# EAGLE design osh_fab_tolerance_test (EAGLE 6.4)
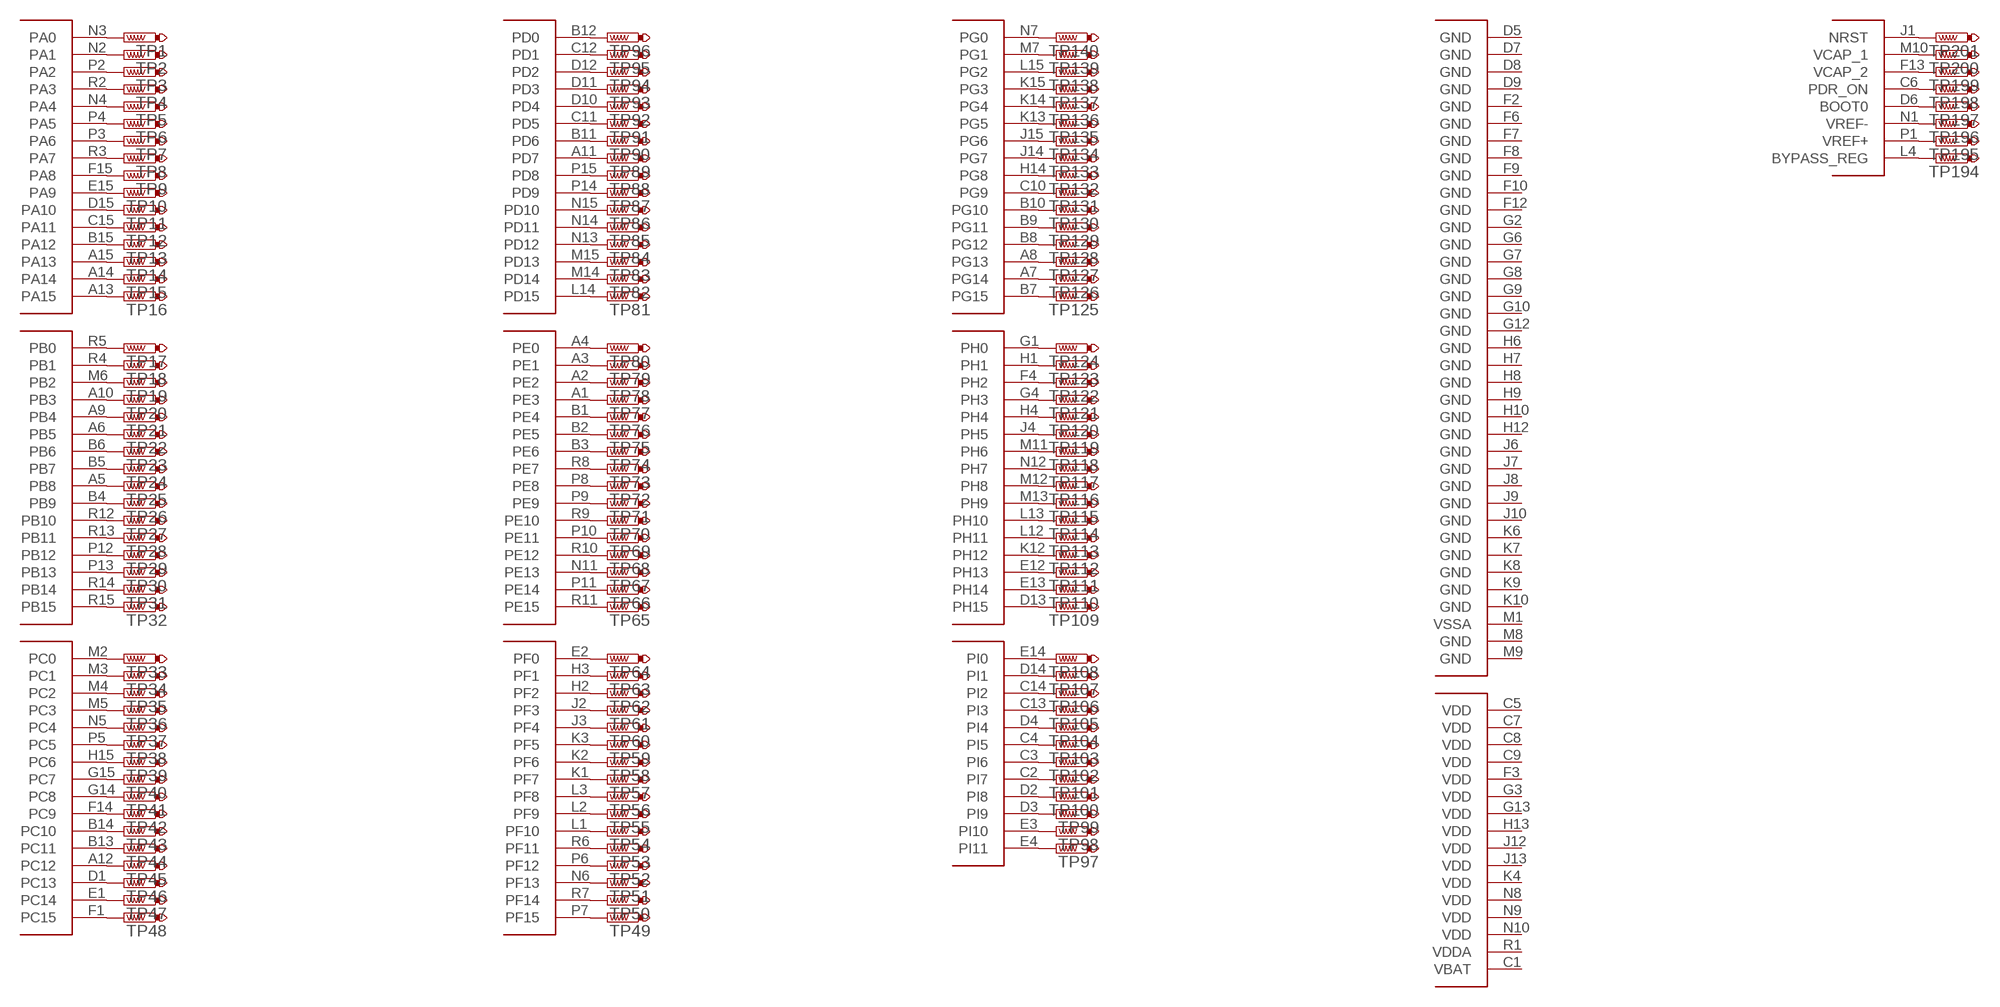
[diagram p0: schematic, sheet 1]

## Parts
TP1  PTR1TP09R  [TP09R]
TP2  PTR1TP09R  [TP09R]
TP3  PTR1TP09R  [TP09R]
TP4  PTR1TP09R  [TP09R]
TP5  PTR1TP09R  [TP09R]
TP6  PTR1TP09R  [TP09R]
TP7  PTR1TP09R  [TP09R]
TP8  PTR1TP09R  [TP09R]
TP9  PTR1TP09R  [TP09R]
TP10  PTR1TP09R  [TP09R]
TP11  PTR1TP09R  [TP09R]
TP12  PTR1TP09R  [TP09R]
TP13  PTR1TP09R  [TP09R]
TP14  PTR1TP09R  [TP09R]
TP15  PTR1TP09R  [TP09R]
TP16  PTR1TP09R  [TP09R]
TP17  PTR1TP09R  [TP09R]
TP18  PTR1TP09R  [TP09R]
TP19  PTR1TP09R  [TP09R]
TP20  PTR1TP09R  [TP09R]
TP21  PTR1TP09R  [TP09R]
TP22  PTR1TP09R  [TP09R]
TP23  PTR1TP09R  [TP09R]
TP24  PTR1TP09R  [TP09R]
TP25  PTR1TP09R  [TP09R]
TP26  PTR1TP09R  [TP09R]
TP27  PTR1TP09R  [TP09R]
TP28  PTR1TP09R  [TP09R]
TP29  PTR1TP09R  [TP09R]
TP30  PTR1TP09R  [TP09R]
TP31  PTR1TP09R  [TP09R]
TP32  PTR1TP09R  [TP09R]
TP33  PTR1TP09R  [TP09R]
TP34  PTR1TP09R  [TP09R]
TP35  PTR1TP09R  [TP09R]
TP36  PTR1TP09R  [TP09R]
TP37  PTR1TP09R  [TP09R]
TP38  PTR1TP09R  [TP09R]
TP39  PTR1TP09R  [TP09R]
TP40  PTR1TP09R  [TP09R]
TP41  PTR1TP09R  [TP09R]
TP42  PTR1TP09R  [TP09R]
TP43  PTR1TP09R  [TP09R]
TP44  PTR1TP09R  [TP09R]
TP45  PTR1TP09R  [TP09R]
TP46  PTR1TP09R  [TP09R]
TP47  PTR1TP09R  [TP09R]
TP48  PTR1TP09R  [TP09R]
TP49  PTR1TP09R  [TP09R]
TP50  PTR1TP09R  [TP09R]
TP51  PTR1TP09R  [TP09R]
TP52  PTR1TP09R  [TP09R]
TP53  PTR1TP09R  [TP09R]
TP54  PTR1TP09R  [TP09R]
TP55  PTR1TP09R  [TP09R]
TP56  PTR1TP09R  [TP09R]
TP57  PTR1TP09R  [TP09R]
TP58  PTR1TP09R  [TP09R]
TP59  PTR1TP09R  [TP09R]
TP60  PTR1TP09R  [TP09R]
TP61  PTR1TP09R  [TP09R]
TP62  PTR1TP09R  [TP09R]
TP63  PTR1TP09R  [TP09R]
TP64  PTR1TP09R  [TP09R]
TP65  PTR1TP09R  [TP09R]
TP66  PTR1TP09R  [TP09R]
TP67  PTR1TP09R  [TP09R]
TP68  PTR1TP09R  [TP09R]
TP69  PTR1TP09R  [TP09R]
TP70  PTR1TP09R  [TP09R]
TP71  PTR1TP09R  [TP09R]
TP72  PTR1TP09R  [TP09R]
TP73  PTR1TP09R  [TP09R]
TP74  PTR1TP09R  [TP09R]
TP75  PTR1TP09R  [TP09R]
TP76  PTR1TP09R  [TP09R]
TP77  PTR1TP09R  [TP09R]
TP78  PTR1TP09R  [TP09R]
TP79  PTR1TP09R  [TP09R]
TP80  PTR1TP09R  [TP09R]
TP81  PTR1TP09R  [TP09R]
TP82  PTR1TP09R  [TP09R]
TP83  PTR1TP09R  [TP09R]
TP84  PTR1TP09R  [TP09R]
TP85  PTR1TP09R  [TP09R]
TP86  PTR1TP09R  [TP09R]
TP87  PTR1TP09R  [TP09R]
TP88  PTR1TP09R  [TP09R]
TP89  PTR1TP09R  [TP09R]
TP90  PTR1TP09R  [TP09R]
TP91  PTR1TP09R  [TP09R]
TP92  PTR1TP09R  [TP09R]
TP93  PTR1TP09R  [TP09R]
TP94  PTR1TP09R  [TP09R]
TP95  PTR1TP09R  [TP09R]
TP96  PTR1TP09R  [TP09R]
TP97  PTR1TP09R  [TP09R]
TP98  PTR1TP09R  [TP09R]
TP99  PTR1TP09R  [TP09R]
TP100  PTR1TP09R  [TP09R]
TP101  PTR1TP09R  [TP09R]
TP102  PTR1TP09R  [TP09R]
TP103  PTR1TP09R  [TP09R]
TP104  PTR1TP09R  [TP09R]
TP105  PTR1TP09R  [TP09R]
TP106  PTR1TP09R  [TP09R]
TP107  PTR1TP09R  [TP09R]
TP108  PTR1TP09R  [TP09R]
TP109  PTR1TP09R  [TP09R]
TP110  PTR1TP09R  [TP09R]
TP111  PTR1TP09R  [TP09R]
TP112  PTR1TP09R  [TP09R]
TP113  PTR1TP09R  [TP09R]
TP114  PTR1TP09R  [TP09R]
TP115  PTR1TP09R  [TP09R]
TP116  PTR1TP09R  [TP09R]
TP117  PTR1TP09R  [TP09R]
TP118  PTR1TP09R  [TP09R]
TP119  PTR1TP09R  [TP09R]
TP120  PTR1TP09R  [TP09R]
TP121  PTR1TP09R  [TP09R]
TP122  PTR1TP09R  [TP09R]
TP123  PTR1TP09R  [TP09R]
TP124  PTR1TP09R  [TP09R]
TP125  PTR1TP09R  [TP09R]
TP126  PTR1TP09R  [TP09R]
TP127  PTR1TP09R  [TP09R]
TP128  PTR1TP09R  [TP09R]
TP129  PTR1TP09R  [TP09R]
TP130  PTR1TP09R  [TP09R]
TP131  PTR1TP09R  [TP09R]
TP132  PTR1TP09R  [TP09R]
TP133  PTR1TP09R  [TP09R]
TP134  PTR1TP09R  [TP09R]
TP135  PTR1TP09R  [TP09R]
TP136  PTR1TP09R  [TP09R]
TP137  PTR1TP09R  [TP09R]
TP138  PTR1TP09R  [TP09R]
TP139  PTR1TP09R  [TP09R]
TP140  PTR1TP09R  [TP09R]
TP194  PTR1TP09R  [TP09R]
TP195  PTR1TP09R  [TP09R]
TP196  PTR1TP09R  [TP09R]
TP197  PTR1TP09R  [TP09R]
TP198  PTR1TP09R  [TP09R]
TP199  PTR1TP09R  [TP09R]
TP200  PTR1TP09R  [TP09R]
TP201  PTR1TP09R  [TP09R]
U$1  STM32_32BIT_MCU_STM32F407IG  [STM32_32BIT_MCU_UFBGA176+25]

## Nets
N$1: TP1.TP U$1.N3(PA0)
N$2: TP2.TP U$1.N2(PA1)
N$3: TP3.TP U$1.P2(PA2)
N$4: TP4.TP U$1.R2(PA3)
N$5: TP5.TP U$1.N4(PA4)
N$6: TP6.TP U$1.P4(PA5)
N$7: TP7.TP U$1.P3(PA6)
N$8: TP8.TP U$1.R3(PA7)
N$9: TP9.TP U$1.F15(PA8)
N$10: TP10.TP U$1.E15(PA9)
N$11: TP11.TP U$1.D15(PA10)
N$12: TP12.TP U$1.C15(PA11)
N$13: TP13.TP U$1.B15(PA12)
N$14: TP14.TP U$1.A15(PA13)
N$15: TP15.TP U$1.A14
N$16: TP16.TP U$1.A13(PA15)
N$17: TP17.TP U$1.R5(PB0)
N$18: TP18.TP U$1.R4(PB1)
N$19: TP19.TP U$1.M6(PB2)
N$20: TP20.TP U$1.A10(PB3)
N$21: TP21.TP U$1.A9(PB4)
N$22: TP22.TP U$1.A6(PB5)
N$23: TP23.TP U$1.B6
N$24: TP24.TP U$1.B5(PB7)
N$25: TP25.TP U$1.A5(PB8)
N$26: TP26.TP U$1.B4(PB9)
N$27: TP27.TP U$1.R12(PB10)
N$28: TP28.TP U$1.R13(PB11)
N$29: TP29.TP U$1.P12(PB12)
N$30: TP30.TP U$1.P13(PB13)
N$31: TP31.TP U$1.R14(PB14)
N$32: TP32.TP U$1.R15(PB15)
N$33: TP33.TP U$1.M2(PC0)
N$34: TP34.TP U$1.M3(PC1)
N$35: TP35.TP U$1.M4(PC2)
N$36: TP36.TP U$1.M5(PC3)
N$37: TP37.TP U$1.N5(PC4)
N$38: TP38.TP U$1.P5(PC5)
N$39: TP39.TP U$1.H15(PC6)
N$40: TP40.TP U$1.G15(PC7)
N$41: TP41.TP U$1.G14(PC8)
N$42: TP42.TP U$1.F14(PC9)
N$43: TP43.TP U$1.B14(PC10)
N$44: TP44.TP U$1.B13(PC11)
N$45: TP45.TP U$1.A12(PC12)
N$46: TP46.TP U$1.D1(PC13)
N$47: TP47.TP U$1.E1(PC14)
N$48: TP48.TP U$1.F1(PC15)
N$49: TP49.TP U$1.P7(PF15)
N$50: TP50.TP U$1.R7(PF14)
N$51: TP51.TP U$1.N6(PF13)
N$52: TP52.TP U$1.P6(PF12)
N$53: TP53.TP U$1.R6(PF11)
N$54: TP54.TP U$1.L1(PF10)
N$55: TP55.TP U$1.L2(PF9)
N$56: TP56.TP U$1.L3(PF8)
N$57: TP57.TP U$1.K1(PF7)
N$58: TP58.TP U$1.K2(PF6)
N$59: TP59.TP U$1.K3(PF5)
N$60: TP60.TP U$1.J3(PF4)
N$61: TP61.TP U$1.J2(PF3)
N$62: TP62.TP U$1.H2(PF2)
N$63: TP63.TP U$1.H3(PF1)
N$64: TP64.TP U$1.E2(PF0)
N$65: TP65.TP U$1.R11(PE15)
N$66: TP66.TP U$1.P11(PE14)
N$67: TP67.TP U$1.N11(PE13)
N$68: TP68.TP U$1.R10(PE12)
N$69: TP69.TP U$1.P10(PE11)
N$70: TP70.TP U$1.R9(PE10)
N$71: TP71.TP U$1.P9(PE9)
N$72: TP72.TP U$1.P8(PE8)
N$73: TP73.TP U$1.R8(PE7)
N$74: TP74.TP U$1.B3(PE6)
N$75: TP75.TP U$1.B2(PE5)
N$76: TP76.TP U$1.B1(PE4)
N$77: TP77.TP U$1.A1(PE3)
N$78: TP78.TP U$1.A2(PE2)
N$79: TP79.TP U$1.A3(PE1)
N$80: TP80.TP U$1.A4(PE0)
N$81: TP81.TP U$1.L14(PD15)
N$82: TP82.TP U$1.M14(PD14)
N$83: TP83.TP U$1.M15(PD13)
N$84: TP84.TP U$1.N13(PD12)
N$85: TP85.TP U$1.N14(PD11)
N$86: TP86.TP U$1.N15(PD10)
N$87: TP87.TP U$1.P14(PD9)
N$88: TP88.TP U$1.P15(PD8)
N$89: TP89.TP U$1.A11(PD7)
N$90: TP90.TP U$1.B11(PD6)
N$91: TP91.TP U$1.C11(PD5)
N$92: TP92.TP U$1.D10(PD4)
N$93: TP93.TP U$1.D11(PD3)
N$94: TP94.TP U$1.D12(PD2)
N$95: TP95.TP U$1.C12(PD1)
N$96: TP96.TP U$1.B12(PD0)
N$97: TP97.TP U$1.E4(PI11)
N$98: TP98.TP U$1.E3(PI10)
N$99: TP99.TP U$1.D3(PI9)
N$100: TP100.TP U$1.D2(PI8)
N$101: TP101.TP U$1.C2(PI7)
N$102: TP102.TP U$1.C3(PI6)
N$103: TP103.TP U$1.C4(PI5)
N$104: TP104.TP U$1.D4(PI4)
N$105: TP105.TP U$1.C13(PI3)
N$106: TP106.TP U$1.C14(PI2)
N$107: TP107.TP U$1.D14(PI1)
N$108: TP108.TP U$1.E14(PI0)
N$109: TP109.TP U$1.D13(PH15)
N$110: TP110.TP U$1.E13(PH14)
N$111: TP111.TP U$1.E12(PH13)
N$112: TP112.TP U$1.K12(PH12)
N$113: TP113.TP U$1.L12(PH11)
N$114: TP114.TP U$1.L13(PH10)
N$115: TP115.TP U$1.M13(PH9)
N$116: TP116.TP U$1.M12(PH8)
N$117: TP117.TP U$1.N12(PH7)
N$118: TP118.TP U$1.M11(PH6)
N$119: TP119.TP U$1.J4(PH5)
N$120: TP120.TP U$1.H4
N$121: TP121.TP U$1.G4(PH3)
N$122: TP122.TP U$1.F4(PH2)
N$123: TP123.TP U$1.H1
N$124: TP124.TP U$1.G1(PH0)
N$125: TP125.TP U$1.B7(PG15)
N$126: TP126.TP U$1.A7(PG14)
N$127: TP127.TP U$1.A8(PG13)
N$128: TP128.TP U$1.B8(PG12)
N$129: TP129.TP U$1.B9(PG11)
N$130: TP130.TP U$1.B10(PG10)
N$131: TP131.TP U$1.C10(PG9)
N$132: TP132.TP U$1.H14(PG8)
N$133: TP133.TP U$1.J14(PG7)
N$134: TP134.TP U$1.J15(PG6)
N$135: TP135.TP U$1.K13(PG5)
N$136: TP136.TP U$1.K14(PG4)
N$137: TP137.TP U$1.K15(PG3)
N$138: TP138.TP U$1.L15(PG2)
N$139: TP139.TP U$1.M7(PG1)
N$140: TP140.TP U$1.N7(PG0)
N$194: TP194.TP U$1.L4(BYPASS_REG)
N$195: TP195.TP U$1.P1(VREF+)
N$196: TP196.TP U$1.N1(VREF-)
N$197: TP197.TP U$1.D6(BOOT0)
N$198: TP198.TP U$1.C6(PDR_ON)
N$199: TP199.TP U$1.F13(VCAP_2)
N$200: TP200.TP U$1.M10(VCAP_1)
N$201: TP201.TP U$1.J1(NRST)
Unconnected: U$1.C1(VBAT) U$1.C5(VDD) U$1.C7(VDD) U$1.C8(VDD) U$1.C9(VDD) U$1.D5(GND) U$1.D7(GND) U$1.D8(GND) U$1.D9(GND) U$1.F2(GND) U$1.F3(VDD) U$1.F6(GND) U$1.F7(GND) U$1.F8(GND) U$1.F9(GND) U$1.F10(GND) U$1.F12(GND) U$1.G2(GND) U$1.G3(VDD) U$1.G6(GND) U$1.G7(GND) U$1.G8(GND) U$1.G9(GND) U$1.G10(GND) U$1.G12(GND) U$1.G13(VDD) U$1.H6(GND) U$1.H7(GND) U$1.H8(GND) U$1.H9(GND) U$1.H10(GND) U$1.H12(GND) U$1.H13(VDD) U$1.J6(GND) U$1.J7(GND) U$1.J8(GND) U$1.J9(GND) U$1.J10(GND) U$1.J12(VDD) U$1.J13(VDD) U$1.K4(VDD) U$1.K6(GND) U$1.K7(GND) U$1.K8(GND) U$1.K9(GND) U$1.K10(GND) U$1.M1(VSSA) U$1.M8(GND) U$1.M9(GND) U$1.N8(VDD) U$1.N9(VDD) U$1.N10(VDD) U$1.R1(VDDA)

## Library data of the parts
TP1-TP140 TP194-TP201 = testpad:PTR1: TEST PIN
U$1 = logic:STM32_32BIT_MCU_STM32F407IG

## Board
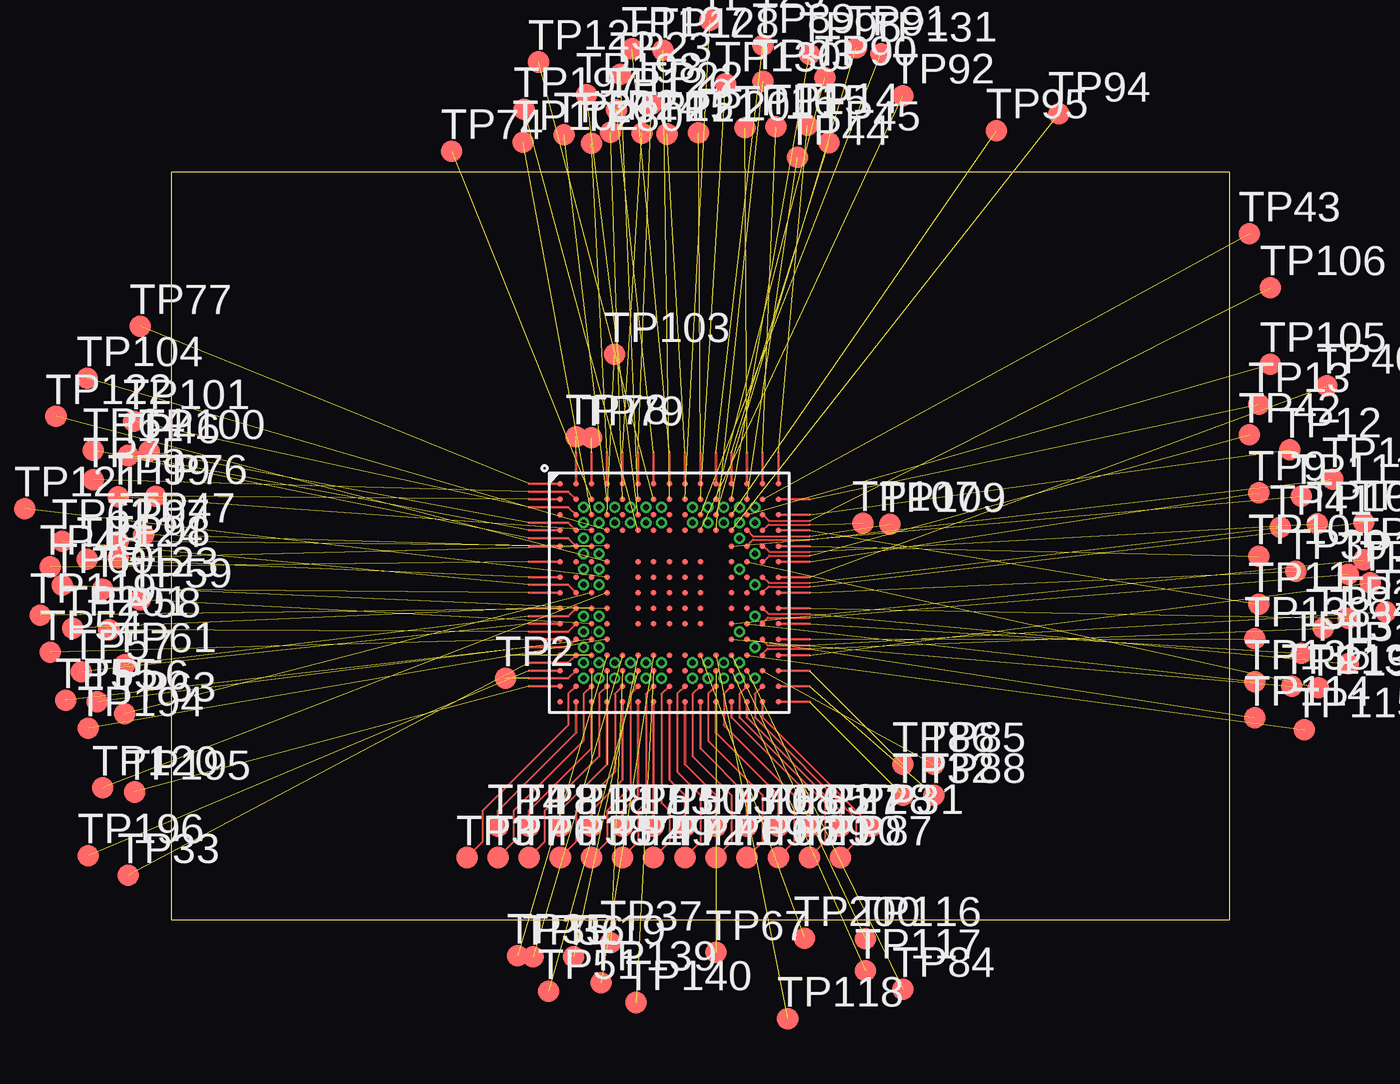
[diagram p1: board, top side]
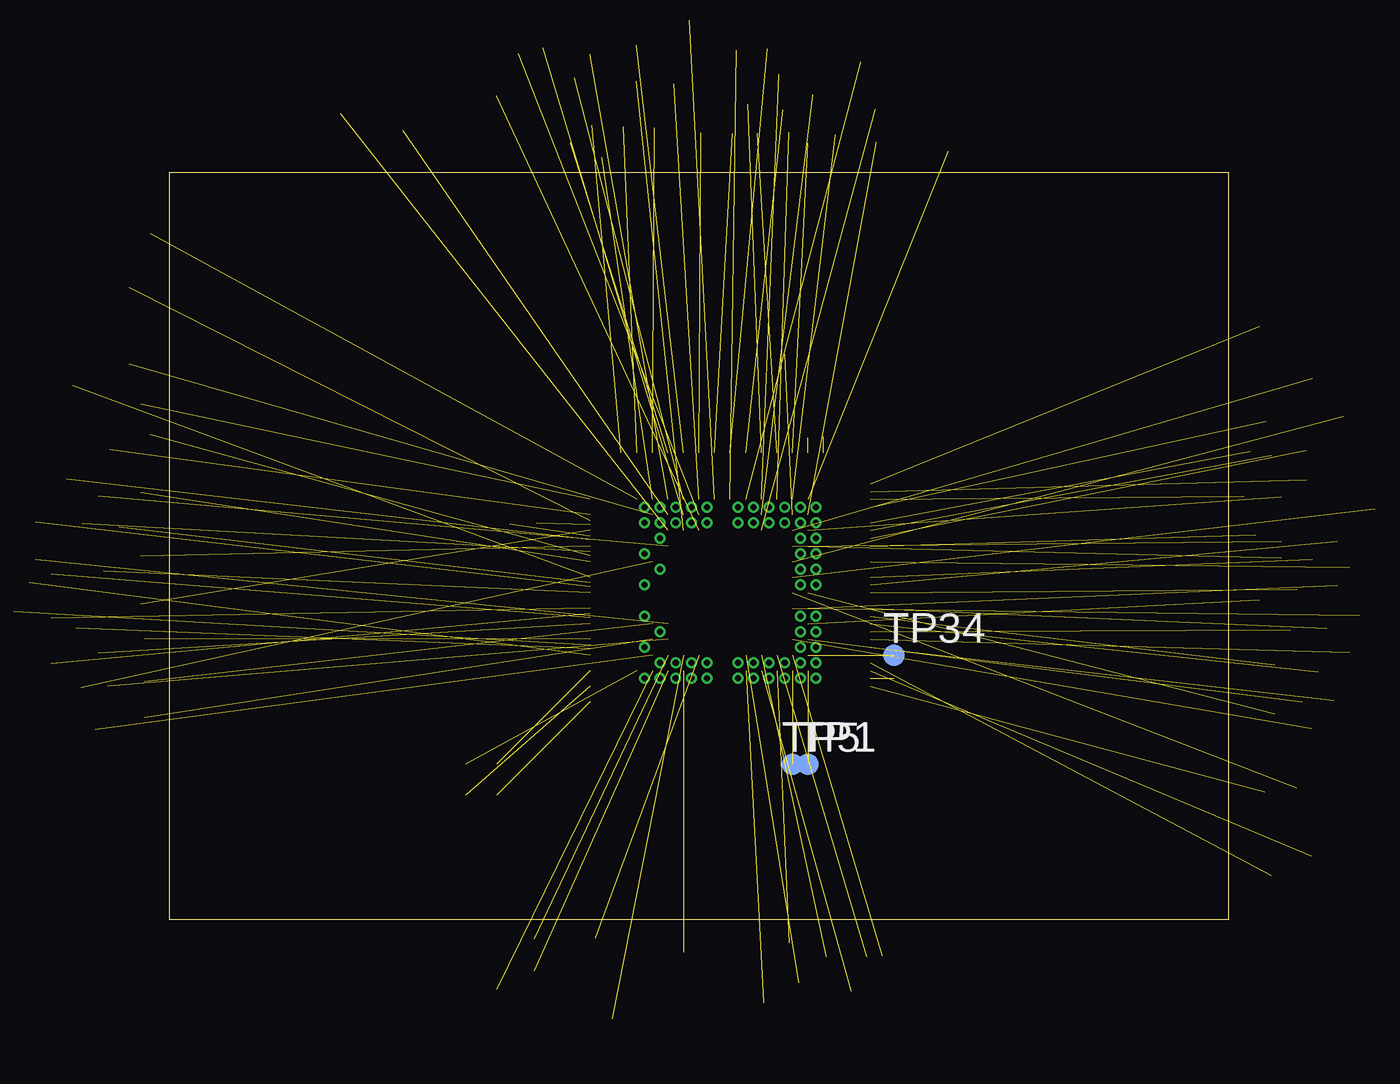
[diagram p2: board, bottom side, seen from below]

Size 44.2 x 31.2 mm. Coordinates in mm from the lower left corner, seen from the top.
Outline: 0,0 44.2,0 44.2,31.2 0,31.2 0,0
Copper layers (1*2*3*16): Top 0.035mm / dielectric 1.5mm / Route2 0.035mm / dielectric 0.15mm / Route3 0.035mm / dielectric 0.2mm / Bottom 0.035mm
Design rules "default *": minimum track width 3mil, minimum drill 10mil, track to track 3mil, track to pad 3mil, pad to pad 3mil, via to via 3mil, smd to smd 3mil, copper to edge 15mil, drill to drill 8mil, minimum pad ring 4mil, minimum via ring 4mil, stop-mask expansion 4mil, vias tented up to drill 16mil, thermal gap 10mil

### Footprints (pad centres in the part's own frame; a part is rotated, then mirrored left to right if it is on the bottom)
TP09R = smd 0.9 x 0.9: TP 0,0
STM32_32BIT_MCU_UFBGA176+25 = smd 0.23 x 0.23: A1 -4.55,4.55; A2 -3.9,4.55; A3 -3.25,4.55; A4 -2.6,4.55; A5 -1.95,4.55; A6 -1.3,4.55; A7 -0.65,4.55; A8 0,4.55; A9 0.65,4.55; A10 1.3,4.55; A11 1.95,4.55; A12 2.6,4.55; A13 3.25,4.55; A14 3.9,4.55; A15 4.55,4.55; B1 -4.55,3.9; B2 -3.9,3.9; B3 -3.25,3.9; B4 -2.6,3.9; B5 -1.95,3.9; B6 -1.3,3.9; B7 -0.65,3.9; B8 0,3.9; B9 0.65,3.9; B10 1.3,3.9; B11 1.95,3.9; B12 2.6,3.9; B13 3.25,3.9; B14 3.9,3.9; B15 4.55,3.9; C1 -4.55,3.25; C2 -3.9,3.25; C3 -3.25,3.25; C4 -2.6,3.25; C5 -1.95,3.25; C6 -1.3,3.25; C7 -0.65,3.25; C8 0,3.25; C9 0.65,3.25; C10 1.3,3.25; C11 1.95,3.25; C12 2.6,3.25; C13 3.25,3.25; C14 3.9,3.25; C15 4.55,3.25; D1 -4.55,2.6; D2 -3.9,2.6; D3 -3.25,2.6; D4 -2.6,2.6; D5 -1.95,2.6; D6 -1.3,2.6; D7 -0.65,2.6; D8 0,2.6; D9 0.65,2.6; D10 1.3,2.6; D11 1.95,2.6; D12 2.6,2.6; D13 3.25,2.6; D14 3.9,2.6; D15 4.55,2.6; E1 -4.55,1.95; E2 -3.9,1.95; E3 -3.25,1.95; E4 -2.6,1.95; E12 2.6,1.95; E13 3.25,1.95; E14 3.9,1.95; E15 4.55,1.95; F1 -4.55,1.3; F2 -3.9,1.3; F3 -3.25,1.3; F4 -2.6,1.3; F6 -1.3,1.3; F7 -0.65,1.3; F8 0,1.3; F9 0.65,1.3; F10 1.3,1.3; F12 2.6,1.3; F13 3.25,1.3; F14 3.9,1.3; F15 4.55,1.3; G1 -4.55,0.65; G2 -3.9,0.65; G3 -3.25,0.65; G4 -2.6,0.65; G6 -1.3,0.65; G7 -0.65,0.65; G8 0,0.65; G9 0.65,0.65; G10 1.3,0.65; G12 2.6,0.65; G13 3.25,0.65; G14 3.9,0.65; G15 4.55,0.65; H1 -4.55,0; H2 -3.9,0; H3 -3.25,0; H4 -2.6,0; H6 -1.3,0; H7 -0.65,0; H8 0,0; H9 0.65,0; H10 1.3,0; H12 2.6,0; H13 3.25,0; H14 3.9,0; H15 4.55,0; J1 -4.55,-0.65; J2 -3.9,-0.65; J3 -3.25,-0.65; J4 -2.6,-0.65; J6 -1.3,-0.65; J7 -0.65,-0.65; J8 0,-0.65; J9 0.65,-0.65; J10 1.3,-0.65; J12 2.6,-0.65; J13 3.25,-0.65; J14 3.9,-0.65; J15 4.55,-0.65; K1 -4.55,-1.3; K2 -3.9,-1.3; K3 -3.25,-1.3; K4 -2.6,-1.3; K6 -1.3,-1.3; K7 -0.65,-1.3; K8 0,-1.3; K9 0.65,-1.3; K10 1.3,-1.3; K12 2.6,-1.3; K13 3.25,-1.3; K14 3.9,-1.3; K15 4.55,-1.3; L1 -4.55,-1.95; L2 -3.9,-1.95; L3 -3.25,-1.95; L4 -2.6,-1.95; L12 2.6,-1.95; L13 3.25,-1.95; L14 3.9,-1.95; L15 4.55,-1.95; M1 -4.55,-2.6; M2 -3.9,-2.6; M3 -3.25,-2.6; M4 -2.6,-2.6; M5 -1.95,-2.6; M6 -1.3,-2.6; M7 -0.65,-2.6; M8 0,-2.6; M9 0.65,-2.6; M10 1.3,-2.6; M11 1.95,-2.6; M12 2.6,-2.6; M13 3.25,-2.6; M14 3.9,-2.6; M15 4.55,-2.6; N1 -4.55,-3.25; N2 -3.9,-3.25; N3 -3.25,-3.25; N4 -2.6,-3.25; N5 -1.95,-3.25; N6 -1.3,-3.25; N7 -0.65,-3.25; N8 0,-3.25; N9 0.65,-3.25; N10 1.3,-3.25; N11 1.95,-3.25; N12 2.6,-3.25; N13 3.25,-3.25; N14 3.9,-3.25; N15 4.55,-3.25; P1 -4.55,-3.9; P2 -3.9,-3.9; P3 -3.25,-3.9; P4 -2.6,-3.9; P5 -1.95,-3.9; P6 -1.3,-3.9; P7 -0.65,-3.9; P8 0,-3.9; P9 0.65,-3.9; P10 1.3,-3.9; P11 1.95,-3.9; P12 2.6,-3.9; P13 3.25,-3.9; P14 3.9,-3.9; P15 4.55,-3.9; R1 -4.55,-4.55; R2 -3.9,-4.55; R3 -3.25,-4.55; R4 -2.6,-4.55; R5 -1.95,-4.55; R6 -1.3,-4.55; R7 -0.65,-4.55; R8 0,-4.55; R9 0.65,-4.55; R10 1.3,-4.55; R11 1.95,-4.55; R12 2.6,-4.55; R13 3.25,-4.55; R14 3.9,-4.55; R15 4.55,-4.55

### Placement (x,y rotation side)
TP1  17.55,6.5 0 bottom
TP2  13.97,10.08 0 top
TP3  12.35,2.6 0 top
TP4  13.65,3.9 0 top
TP5  18.2,6.5 0 bottom
TP6  14.95,2.6 0 top
TP7  13.65,2.6 0 top
TP8  14.95,3.9 0 top
TP9  45.41,17.82 0 top
TP10  45.41,15.17 0 top
TP11  45.41,13.17 0 top
TP12  46.71,19.61 0 top
TP13  45.41,21.51 0 top
TP14  26.56,33.16 0 top
TP15  25.26,33.11 0 top
TP16  23.96,33.06 0 top
TP17  17.55,3.9 0 top
TP18  16.25,3.9 0 top
TP19  16.81,-1.55 0 top
TP20  22.01,32.85 0 top
TP21  20.71,32.8 0 top
TP22  20.06,34.04 0 top
TP23  18.76,35.29 0 top  (outside the outline)
TP24  18.36,32.87 0 top
TP25  19.66,32.82 0 top
TP26  16.41,32.77 0 top
TP27  26.65,3.9 0 top
TP28  27.95,3.9 0 top
TP29  25.35,2.6 0 top
TP30  26.65,2.6 0 top
TP31  29.25,3.9 0 top
TP32  30.55,5.2 0 top
TP33  -1.79,1.85 0 top
TP34  13.97,11.05 0 bottom
TP35  14.46,-1.5 0 top
TP36  15.11,-1.55 0 top
TP37  18.36,-0.95 0 top
TP38  16.25,2.6 0 top
TP39  46.96,14.54 0 top
TP40  48.26,22.29 0 top  (outside the outline)
TP41  46.31,16.39 0 top
TP42  45.01,20.24 0 top
TP43  45.01,28.63 0 top
TP44  26.16,31.83 0 top
TP45  27.46,32.43 0 top
TP46  -1.79,19.38 0 top
TP47  -1.14,16.08 0 top
TP48  -5.04,14.72 0 top  (outside the outline)
TP49  18.85,2.6 0 top
TP50  20.15,3.9 0 top
TP51  15.76,-2.98 0 top
TP52  17.55,2.6 0 top
TP53  18.85,3.9 0 top
TP54  -5.04,11.16 0 top  (outside the outline)
TP55  -4.39,9.16 0 top  (outside the outline)
TP56  -3.09,9.11 0 top  (outside the outline)
TP57  -3.74,10.36 0 top  (outside the outline)
TP58  -2.59,12.11 0 top
TP59  -1.29,13.36 0 top
TP60  -4.54,13.95 0 top  (outside the outline)
TP61  -1.94,10.65 0 top
TP62  -4.54,15.8 0 top  (outside the outline)
TP63  -1.94,8.6 0 top
TP64  -3.24,19.6 0 top  (outside the outline)
TP65  25.35,3.9 0 top
TP66  24.05,2.6 0 top
TP67  22.76,-1.36 0 top
TP68  24.05,3.9 0 top
TP69  22.75,2.6 0 top
TP70  22.75,3.9 0 top
TP71  21.45,2.6 0 top
TP72  20.15,2.6 0 top
TP73  21.45,3.9 0 top
TP74  11.71,32.08 0 top
TP75  -3.24,18.38 0 top  (outside the outline)
TP76  -0.64,17.67 0 top
TP77  -1.29,24.77 0 top
TP78  16.91,20.17 0 top
TP79  17.56,20.12 0 top
TP80  17.56,32.41 0 top
TP81  50.71,12.86 0 top  (outside the outline)
TP82  48.11,12.16 0 top  (outside the outline)
TP83  50.06,14.06 0 top  (outside the outline)
TP84  30.56,-2.89 0 top
TP85  31.85,6.5 0 top
TP86  30.55,6.5 0 top
TP87  27.95,2.6 0 top
TP88  31.85,5.2 0 top
TP89  24.71,36.5 0 top  (outside the outline)
TP90  27.31,35.15 0 top  (outside the outline)
TP91  28.61,36.39 0 top  (outside the outline)
TP92  30.56,34.39 0 top  (outside the outline)
TP93  24.71,34.99 0 top  (outside the outline)
TP94  37.06,33.64 0 top
TP95  34.46,32.93 0 top
TP96  26.66,36.13 0 top  (outside the outline)
TP97  -2.21,15.81 0 top
TP98  -2.21,15.11 0 top
TP99  -2.21,17.65 0 top
TP100  -0.91,19.55 0 top
TP101  -1.55,20.8 0 top
TP102  14.69,32.45 0 top
TP103  18.51,23.6 0 top
TP104  -3.51,22.59 0 top  (outside the outline)
TP105  45.89,23.19 0 top
TP106  45.89,26.39 0 top
TP107  28.88,16.56 0 top
TP108  47.84,16.54 0 top  (outside the outline)
TP109  30.01,16.51 0 top
TP110  48.49,18.38 0 top  (outside the outline)
TP111  47.19,17.68 0 top
TP112  49.8,15.03 0 top  (outside the outline)
TP113  46.8,9.75 0 top
TP114  45.24,8.42 0 top
TP115  47.32,7.93 0 top  (outside the outline)
TP116  28.99,-0.78 0 top
TP117  28.99,-2.13 0 top
TP118  25.74,-4.13 0 top  (outside the outline)
TP119  -5.46,12.71 0 top  (outside the outline)
TP120  -2.86,5.51 0 top
TP121  -6.11,17.16 0 top  (outside the outline)
TP122  -4.8,21.01 0 top  (outside the outline)
TP123  -2.86,13.8 0 top
TP124  -3.51,15.05 0 top  (outside the outline)
TP125  15.34,35.8 0 top  (outside the outline)
TP126  18.59,33.8 0 top
TP127  19.24,36.35 0 top  (outside the outline)
TP128  20.55,36.29 0 top  (outside the outline)
TP129  22.49,37.54 0 top  (outside the outline)
TP130  23.14,34.89 0 top  (outside the outline)
TP131  29.64,36.14 0 top  (outside the outline)
TP132  49.8,16.59 0 top  (outside the outline)
TP133  49.14,10.69 0 top  (outside the outline)
TP134  49.14,12.58 0 top  (outside the outline)
TP135  45.24,9.93 0 top
TP136  49.14,14.43 0 top  (outside the outline)
TP137  47.19,11.13 0 top
TP138  45.24,11.73 0 top
TP139  17.94,-2.63 0 top
TP140  19.42,-3.45 0 top  (outside the outline)
TP194  -3.46,7.99 0 top  (outside the outline)
TP195  -1.51,5.33 0 top
TP196  -3.46,2.68 0 top  (outside the outline)
TP197  14.74,33.83 0 top
TP198  17.34,34.43 0 top  (outside the outline)
TP199  47.89,9.68 0 top  (outside the outline)
TP200  26.44,-0.78 0 top
TP201  -4.11,12.17 0 top  (outside the outline)
U$1  20.8,13.65 0 top

### Tracks (layer width: path | path; a pad name or v marks a point on that pad's centre or on a via)
N$1  (1 unrouted)
N$2  (1 unrouted)
  Top 0.102: U$1.N2 16.58,10.08 14.95,10.08
N$3
  Top 0.076: U$1.P2 16.58,9.43 16.58,8.12 13,4.55 13,3.25 TP3.TP
N$4
  Top 0.102: U$1.R2 16.9,7.8 13.65,4.55 TP4.TP
N$5  (1 unrouted)
N$6
  Top 0.076: U$1.P4 17.88,9.43 17.88,6.83 15.6,4.55 15.6,3.25 TP6.TP
N$7
  Top 0.076: U$1.P3 17.22,9.43 17.22,7.48 14.3,4.55 14.3,3.25 TP7.TP
N$8
  Top 0.102: U$1.R3 17.55,7.15 14.95,4.55 TP8.TP
N$9  (1 unrouted)
  Top 0.102: U$1.F15 26.65,14.95
N$10  (1 unrouted)
  Top 0.102: U$1.E15 26.65,15.6
N$11  (1 unrouted)
  Top 0.102: U$1.D15 26.65,16.25
N$12  (1 unrouted)
  Top 0.102: U$1.C15 26.65,16.9
N$13  (1 unrouted)
  Top 0.102: U$1.B15 26.65,17.55
N$14  (1 unrouted)
  Top 0.102: U$1.A15 25.35,19.5
N$15  (1 unrouted)
  Top 0.102: U$1.A14 24.7,19.5
N$16  (1 unrouted)
  Top 0.102: U$1.A13 24.05,19.5
N$17
  Top 0.102: U$1.R5 18.85,5.85 17.55,4.55 TP17.TP
N$18
  Top 0.102: U$1.R4 18.2,6.5 16.25,4.55 TP18.TP
N$19  (1 unrouted)
N$20  (1 unrouted)
  Top 0.102: U$1.A10 22.1,19.5
N$21  (1 unrouted)
  Top 0.102: U$1.A9 21.45,19.5
N$22  (1 unrouted)
  Top 0.102: U$1.A6 19.5,19.5
N$23  (1 unrouted)
N$24  (1 unrouted)
N$25  (1 unrouted)
  Top 0.102: U$1.A5 18.85,19.5
N$26  (1 unrouted)
N$27
  Top 0.102: U$1.R12 23.4,8.45 26.65,5.2 TP27.TP
N$28
  Top 0.102: U$1.R13 24.05,8.45 27.95,4.55 TP28.TP
N$29
  Top 0.076: U$1.P12 23.08,9.43 23.08,8.12 26,5.2 26,3.25 TP29.TP
N$30
  Top 0.076: U$1.P13 23.72,9.43 23.72,8.45 27.3,4.88 27.3,3.25 TP30.TP
N$31
  Top 0.102: U$1.R14 24.7,8.45 TP31.TP
N$32  (1 unrouted)
  Top 0.102: U$1.R15 26.65,9.1
N$33  (1 unrouted)
  Top 0.102: U$1.M2 16.58,10.73 14.95,10.73
N$34  (1 unrouted)
N$35  (1 unrouted)
N$36  (1 unrouted)
N$37  (1 unrouted)
N$38
  Top 0.076: U$1.P5 18.52,9.43 18.52,6.18 16.9,4.55 16.9,3.25 TP38.TP
N$39  (1 unrouted)
  Top 0.102: U$1.H15 26.65,13.65
N$40  (1 unrouted)
  Top 0.102: U$1.G15 26.65,14.3
N$41  (1 unrouted)
  Top 0.076: U$1.G14 24.72,14.3 24.96,14.06 26.66,14.06
N$42  (1 unrouted)
  Top 0.076: U$1.F14 24.73,14.95 24.98,15.2 26.66,15.2
N$43  (1 unrouted)
N$44  (1 unrouted)
N$45  (1 unrouted)
  Top 0.102: U$1.A12 23.4,19.5
N$46  (1 unrouted)
  Top 0.102: U$1.D1 14.95,16.25
N$47  (1 unrouted)
  Top 0.102: U$1.E1 14.95,15.6
N$48  (1 unrouted)
  Top 0.102: U$1.F1 14.95,14.95
N$49
  Top 0.076: U$1.P7 19.83,9.43 19.83,4.88 19.5,4.55 19.5,3.25 TP49.TP
N$50
  Top 0.102: U$1.R7 TP50.TP
N$51  (1 unrouted)
N$52
  Top 0.076: U$1.P6 19.17,9.43 19.17,5.52 18.2,4.55 18.2,3.25 TP52.TP
N$53
  Top 0.102: U$1.R6 19.5,5.2 18.85,4.55 TP53.TP
N$54  (1 unrouted)
  Top 0.102: U$1.L1 14.95,11.7
N$55  (1 unrouted)
  Top 0.102: U$1.L2 16.58,11.38 14.95,11.38
N$56  (1 unrouted)
N$57  (1 unrouted)
  Top 0.102: U$1.K1 14.95,12.35
N$58  (1 unrouted)
  Top 0.102: U$1.K2 16.58,12.02 14.95,12.02
N$59  (1 unrouted)
N$60  (1 unrouted)
N$61  (1 unrouted)
  Top 0.102: U$1.J2 16.58,12.68 14.95,12.68
N$62  (1 unrouted)
  Top 0.102: U$1.H2 16.58,13.98 14.95,13.98
N$63  (1 unrouted)
N$64  (1 unrouted)
  Top 0.102: U$1.E2 16.58,15.93 14.95,15.93
N$65
  Top 0.102: U$1.R11 22.75,7.8 25.35,5.2 TP65.TP
N$66
  Top 0.076: U$1.P11 22.42,9.43 22.42,7.48 24.7,5.2 24.7,3.25 TP66.TP
N$67  (1 unrouted)
N$68
  Top 0.102: U$1.R10 22.1,7.15 24.05,5.2 TP68.TP
N$69
  Top 0.076: U$1.P10 21.77,9.43 21.77,6.83 23.4,5.2 23.4,3.25 TP69.TP
N$70
  Top 0.102: U$1.R9 21.45,6.5 22.75,5.2 TP70.TP
N$71
  Top 0.076: U$1.P9 21.12,9.43 21.12,6.18 22.1,5.2 22.1,3.25 TP71.TP
N$72
  Top 0.076: U$1.P8 20.47,9.43 20.47,4.88 20.8,4.55 20.8,3.25 TP72.TP
N$73
  Top 0.102: U$1.R8 20.8,5.85 21.45,5.2 TP73.TP
N$74  (1 unrouted)
N$75  (1 unrouted)
  Top 0.102: U$1.B2 16.58,17.88 14.95,17.88
N$76  (1 unrouted)
  Top 0.102: U$1.B1 14.95,17.55
N$77  (1 unrouted)
  Top 0.102: U$1.A1 14.95,18.2
N$78  (1 unrouted)
  Top 0.102: U$1.A2 16.9,19.5
N$79  (1 unrouted)
  Top 0.102: U$1.A3 17.55,19.5
N$80  (1 unrouted)
  Top 0.102: U$1.A4 18.2,19.5
N$81  (1 unrouted)
  Top 0.076: U$1.L14 24.7,11.67 24.91,11.47 26.66,11.47
N$82  (1 unrouted)
  Top 0.076: U$1.M14 24.7,11.11 24.91,11.32 26.66,11.32
N$83  (1 unrouted)
  Top 0.102: U$1.M15 26.65,11.05
N$84  (1 unrouted)
N$85  (1 unrouted)
N$86  (1 unrouted)
  Top 0.102: U$1.N15 26.65,10.4
N$87
  Top 0.076: U$1.P14 24.38,9.43 24.38,8.45 28.6,4.23 28.6,3.25 TP87.TP
N$88  (1 unrouted)
  Top 0.102: U$1.P15 26.65,9.75
N$89  (1 unrouted)
  Top 0.102: U$1.A11 22.75,19.5
N$90  (1 unrouted)
N$91  (1 unrouted)
N$92  (1 unrouted)
N$93  (1 unrouted)
N$94  (1 unrouted)
N$95  (1 unrouted)
N$96  (1 unrouted)
N$97  (1 unrouted)
N$98  (1 unrouted)
N$99  (1 unrouted)
N$100  (1 unrouted)
  Top 0.102: U$1.D2 16.58,16.58 14.95,16.58
N$101  (1 unrouted)
  Top 0.102: U$1.C2 16.58,17.23 14.95,17.23
N$102  (1 unrouted)
N$103  (1 unrouted)
N$104  (1 unrouted)
N$105  (1 unrouted)
N$106  (1 unrouted)
  Top 0.076: U$1.C14 24.96,16.65 26.66,16.65
N$107  (1 unrouted)
  Top 0.076: U$1.D14 24.94,16.5 26.66,16.5
N$108  (1 unrouted)
  Top 0.076: U$1.E14 24.74,15.6 24.98,15.35 26.66,15.35
N$109  (1 unrouted)
  Top 0.076: U$1.D13 24.3,16.01 26.66,16.01
N$110  (1 unrouted)
  Top 0.076: U$1.E13 24.05,15.62 24.3,15.86 26.66,15.86
N$111  (1 unrouted)
N$112  (1 unrouted)
N$113  (1 unrouted)
N$114  (1 unrouted)
N$115  (1 unrouted)
N$116  (1 unrouted)
N$117  (1 unrouted)
N$118  (1 unrouted)
N$119  (1 unrouted)
N$120  (1 unrouted)
N$121  (1 unrouted)
N$122  (1 unrouted)
N$123  (1 unrouted)
  Top 0.102: U$1.H1 14.95,13.65
N$124  (1 unrouted)
  Top 0.102: U$1.G1 14.95,14.3
N$125  (1 unrouted)
N$126  (1 unrouted)
  Top 0.102: U$1.A7 20.15,19.5
N$127  (1 unrouted)
  Top 0.102: U$1.A8 20.8,19.5
N$128  (1 unrouted)
N$129  (1 unrouted)
N$130  (1 unrouted)
N$131  (1 unrouted)
N$132  (1 unrouted)
  Top 0.076: U$1.H14 24.94,13.91 26.66,13.91
N$133  (1 unrouted)
  Top 0.076: U$1.J14 24.93,12.76 26.66,12.76
N$134  (1 unrouted)
  Top 0.102: U$1.J15 26.65,13
N$135  (1 unrouted)
N$136  (1 unrouted)
  Top 0.076: U$1.K14 24.7,12.39 24.92,12.61 26.66,12.61
N$137  (1 unrouted)
  Top 0.102: U$1.K15 26.65,12.35
N$138  (1 unrouted)
  Top 0.102: U$1.L15 26.65,11.7
N$139  (1 unrouted)
N$140  (1 unrouted)
N$194  (1 unrouted)
N$195  (1 unrouted)
  Top 0.102: U$1.P1 14.95,9.75
N$196  (1 unrouted)
  Top 0.102: U$1.N1 14.95,10.4
N$197  (1 unrouted)
N$198  (1 unrouted)
N$199  (1 unrouted)
N$200  (1 unrouted)
N$201  (1 unrouted)
  Top 0.102: U$1.J1 14.95,13
N$202  (via drill 0.25)
  other vias: 17.22,17.23
N$203  (via drill 0.25)
  other vias: 17.22,16.58
N$204  (via drill 0.25)
  other vias: 17.22,15.93
N$205  (via drill 0.25)
  other vias: 17.22,15.27
N$206  (via drill 0.25)
  other vias: 17.22,14.62
N$207  (via drill 0.25)
  other vias: 17.22,13.98
N$209  (via drill 0.25)
  other vias: 17.22,12.68
N$210  (via drill 0.25)
  other vias: 17.22,12.02
N$211  (via drill 0.25)
  other vias: 17.22,11.38
N$212  (via drill 0.25)
  other vias: 17.22,10.73
N$213  (via drill 0.25)
  other vias: 17.22,10.08
N$214  (via drill 0.25)
  other vias: 17.88,10.08
N$215  (via drill 0.25)
  other vias: 18.52,10.08
N$216  (via drill 0.25)
  other vias: 19.17,10.08
N$217  (via drill 0.25)
  other vias: 19.83,10.08
N$218  (via drill 0.25)
  other vias: 20.47,10.08
N$220  (via drill 0.25)
  other vias: 21.77,10.08
N$221  (via drill 0.25)
  other vias: 22.42,10.08
N$222  (via drill 0.25)
  other vias: 23.08,10.08
N$223  (via drill 0.25)
  other vias: 23.72,10.08
N$224  (via drill 0.25)
  other vias: 24.38,10.08
N$225  (via drill 0.25)
  other vias: 23.72,10.73
N$227  (via drill 0.25)
  other vias: 23.72,12.02
N$231  (via drill 0.25)
  other vias: 23.72,14.62
N$233  (via drill 0.25)
  other vias: 23.72,15.93
N$234  (via drill 0.25)
  other vias: 24.38,16.58
N$235  (via drill 0.25)
  other vias: 24.38,17.23
N$236  (via drill 0.25)
  other vias: 17.88,17.23
N$237  (via drill 0.25)
  other vias: 18.52,17.23
N$238  (via drill 0.25)
  other vias: 19.17,17.23
N$239  (via drill 0.25)
  other vias: 19.83,17.23
N$240  (via drill 0.25)
  other vias: 20.47,17.23
N$242  (via drill 0.25)
  other vias: 21.77,17.23
N$243  (via drill 0.25)
  other vias: 22.42,17.23
N$244  (via drill 0.25)
  other vias: 23.08,17.23
N$245  (via drill 0.25)
  other vias: 23.72,17.23
N$246  (via drill 0.25)
  other vias: 23.72,16.58
N$247  (via drill 0.25)
  other vias: 23.08,16.58
N$248  (via drill 0.25)
  other vias: 22.42,16.58
N$249  (via drill 0.25)
  other vias: 21.77,16.58
N$251  (via drill 0.25)
  other vias: 20.47,16.58
N$252  (via drill 0.25)
  other vias: 19.83,16.58
N$253  (via drill 0.25)
  other vias: 19.17,16.58
N$254  (via drill 0.25)
  other vias: 18.52,16.58
N$255  (via drill 0.25)
  other vias: 17.88,16.58
N$256  (via drill 0.25)
  other vias: 17.88,15.93
N$257  (via drill 0.25)
  other vias: 17.88,15.27
N$258  (via drill 0.25)
  other vias: 17.88,14.62
N$259  (via drill 0.25)
  other vias: 17.88,13.98
N$261  (via drill 0.25)
  other vias: 17.88,12.68
N$262  (via drill 0.25)
  other vias: 17.88,12.02
N$263  (via drill 0.25)
  other vias: 17.88,11.38
N$264  (via drill 0.25)
  other vias: 17.88,10.73
N$265  (via drill 0.25)
  other vias: 18.52,10.73
N$266  (via drill 0.25)
  other vias: 19.17,10.73
N$267  (via drill 0.25)
  other vias: 19.83,10.73
N$268  (via drill 0.25)
  other vias: 20.47,10.73
N$270  (via drill 0.25)
  other vias: 21.77,10.73
N$271  (via drill 0.25)
  other vias: 22.42,10.73
N$272  (via drill 0.25)
  other vias: 23.08,10.73
N$274  (via drill 0.25)
  other vias: 24.38,11.38
N$276  (via drill 0.25)
  other vias: 24.38,12.68
N$278  (via drill 0.25)
  other vias: 24.38,13.98
N$280  (via drill 0.25)
  other vias: 24.38,15.27